# Altium schematic sheet 3_Demo_PCB.SchDoc
size A4; SheetNumber: 1; SheetTotal: 1
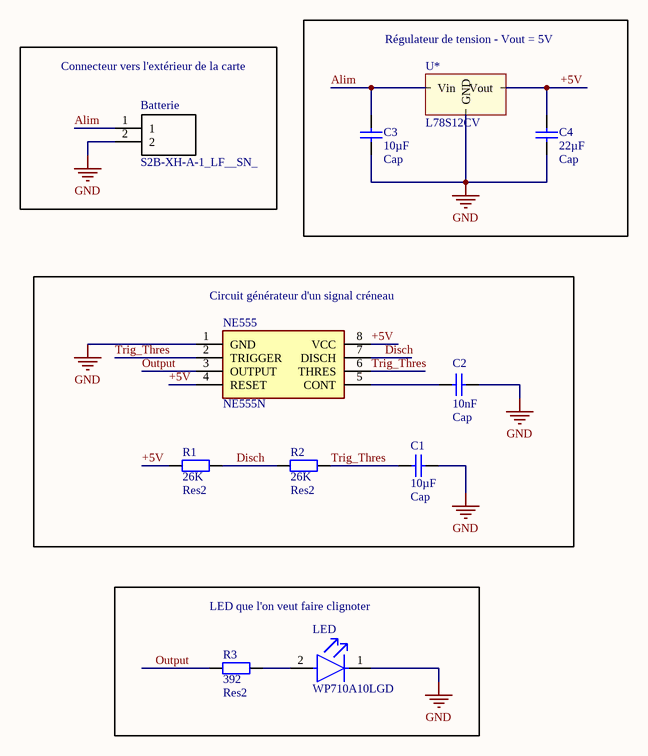
[diagram p0: 3_Demo_PCB.SchDoc]

## Parts
Batterie  S2B-XH-A-1_LF__SN_  [S2B-XH-A]
C1  Cap  value 10µF  [Capacitor 1206]
C2  Cap  value 10nF  [Capacitor 1206]
C3  Cap  value 10µF  [Capacitor 1206]
C4  Cap  value 22µF  [Capacitor 1206]
LED  WP710A10LGD  [FP-WP710A10LGD-MFG]
NE555  NE555N  [DIP762W56P254L959H533Q8N]
R1  Res2  value 26K  [Resistor 1206]
R2  Res2  value 26K  [Resistor 1206]
R3  Res2  value 392  [Resistor 1206]
U*  L78S12CV  [R-78B]

## Blocks framed on the sheet
Régulateur de tension - Vout = 5V: C3 C4 U*
Connecteur vers l'extérieur de la carte: Batterie
Circuit générateur d'un signal créneau: C1 C2 NE555 R1 R2
LED que l'on veut faire clignoter: LED R3

## Nets
GND: Batterie.2 C1.1 C2.2 C3.2 C4.1 LED.1(C) NE555.1(GND) U*.2(GND)
+5V: C4.2 NE555.4(RESET) NE555.8(VCC) R1.2 U*.1(Vout)
Alim: Batterie.1 C3.1 U*.3(Vin)
Disch: NE555.7(DISCH) R1.1 R2.2
Output: NE555.3(OUTPUT) R3.2
Trig_Thres: C1.2 NE555.2(TRIGGER) NE555.6(THRES) R2.1
NetC2_1: C2.1 NE555.5(CONT)
NetLED_2: LED.2(A) R3.1

## Library data of the parts
Batterie = S2B-XH-A-1_LF__SN_: Connector; Manufacturer_Name: JST (JAPAN SOLDERLESS TERMINALS); Manufacturer_Part_Number: S2B-XH-A-1(LF)(SN); Datasheet Link: http://www.jst-mfg.com/product/pdf/eng/eXH.pdf; Height: 6.1mm; Arrow Part Number: S2B-XH-A-1(LF)(SN)
C1-C4 = Cap: Capacitor; Published: 8-Jun-2000; LatestRevisionDate: 17-Jul-2002; LatestRevisionNote: Re-released for DXP Platform.; PackageReference: RAD-0.3; Publisher: Altium Limited; PackageDescription: Radial Cap, Thru-Hole; 2 Leads; 0.3 in Pin Spacing
LED = CMP-00682-20090258-1: WP710A10LGD LED Thru-Hole PCB Green T-1 3mm Green Lens 2 mA 568 nm 2 mcd Round; Number of LEDs: 1; Max Junction Temperature (Tj): 110°C; Viewing Angle: 40°; Reverse Voltage: 5V; Forward Voltage: 1.9V; Dominant Wavelength: 568nm; Luminous Intensity: 2mcd; Power Rating: 62.5mW; Forward Current: 2mA; Lens Style: Diffused, Dome, Round, Tinted; Height: 4.6mm; Mount: Through Hole; Illumination Color: Green; NexarPartId: 20090258; Number of Pins: 3; RoHS: Compliant; Max Operating Temperature: 85°C; Min Operating Temperature: -40°C; Lens Color: Green; Wavelength: 568nm; Color: Green; Schedule B: 8541402000, 8541402000; Case/Package: Radial; Power Dissipation: 62.5mW; Lead Free: Lead Free; Test Current: 2mA
NE555 = NE555N: Integrated Circuit; Manufacturer_Name: HGSEMI; Datasheet Link: https://datasheet.lcsc.com/szlcsc/1906111919_HGSEMI-NE555N_C398063.pdf; Height: 5.33mm; Manufacturer_Part_Number: NE555N
R1-R3 = Res2: Resistor; Published: 8-Jun-2000; LatestRevisionDate: 17-Jul-2002; LatestRevisionNote: Re-released for DXP Platform.; PackageReference: AXIAL-0.4; Publisher: Altium Limited; PackageDescription: Axial Device, Thru-Hole; 2 Leads; 0.4 in Pin Spacing
U* = Régulateur de tension linéaire: Vout: *; A: *